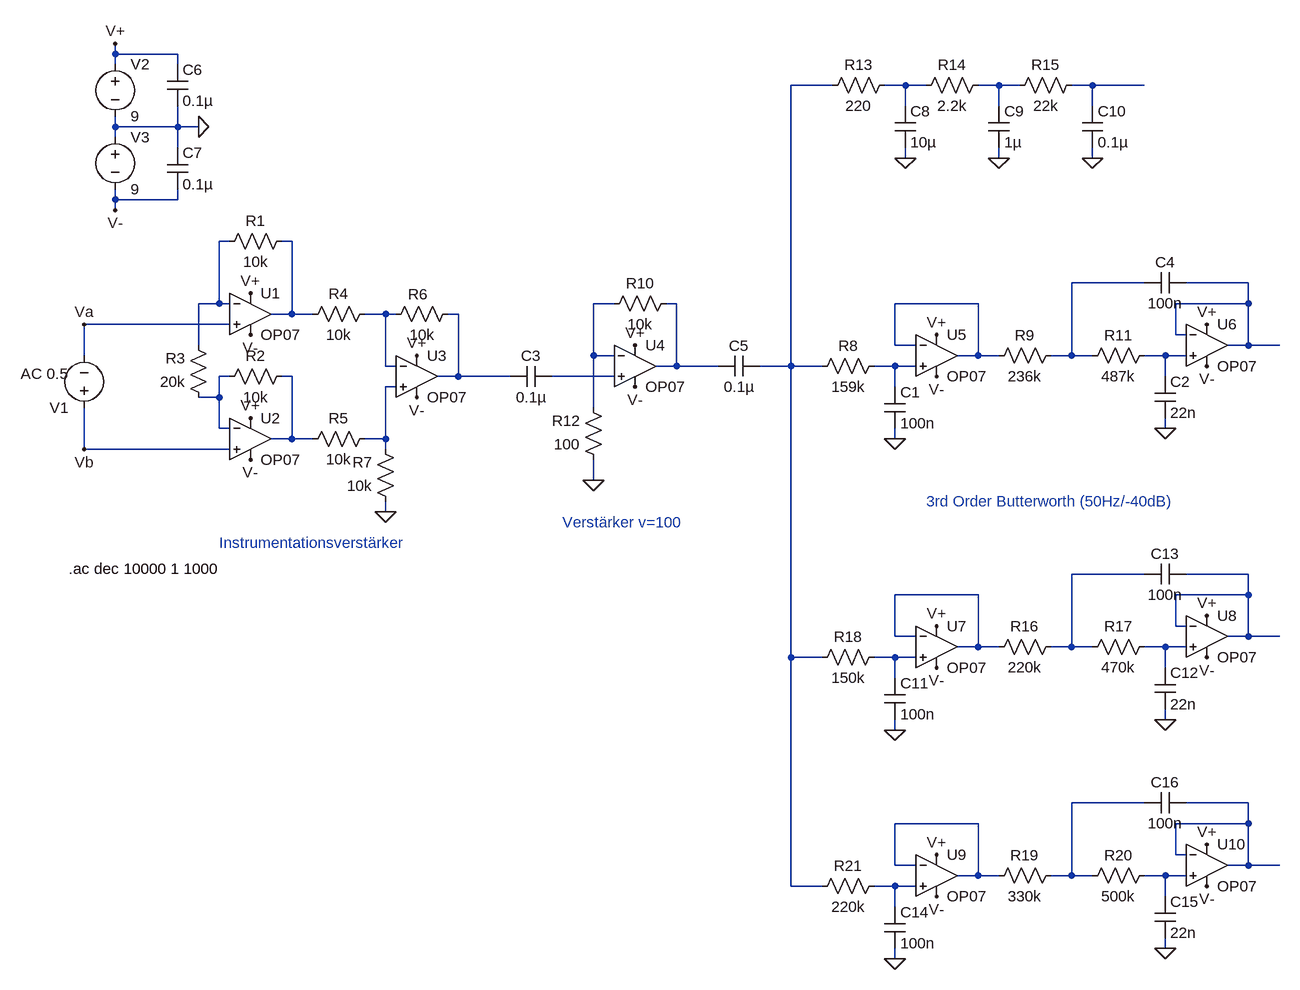
[diagram p0: schematic ekg_v2_butterworth.asc]
ekg_v2_butterworth.asc, the LTspice schematic file:
Version 4
SHEET 1 2228 1156
WIRE 432 -256 432 -272
WIRE 528 -256 432 -256
WIRE 432 -240 432 -256
WIRE 528 -240 528 -256
WIRE 1536 -208 1472 -208
WIRE 1648 -208 1616 -208
WIRE 1680 -208 1648 -208
WIRE 1792 -208 1760 -208
WIRE 1824 -208 1792 -208
WIRE 1936 -208 1904 -208
WIRE 2016 -208 1936 -208
WIRE 1648 -176 1648 -208
WIRE 1792 -176 1792 -208
WIRE 1936 -176 1936 -208
WIRE 432 -144 432 -160
WIRE 528 -144 528 -176
WIRE 528 -144 432 -144
WIRE 560 -144 528 -144
WIRE 432 -128 432 -144
WIRE 528 -112 528 -144
WIRE 1648 -96 1648 -112
WIRE 1792 -96 1792 -112
WIRE 1936 -96 1936 -112
WIRE 432 -32 432 -48
WIRE 528 -32 528 -48
WIRE 528 -32 432 -32
WIRE 432 -16 432 -32
WIRE 608 32 592 32
WIRE 704 32 688 32
WIRE 2016 96 1904 96
WIRE 2176 96 2080 96
WIRE 592 128 592 32
WIRE 592 128 560 128
WIRE 608 128 592 128
WIRE 1200 128 1168 128
WIRE 1296 128 1280 128
WIRE 1760 128 1632 128
WIRE 2176 128 2176 96
WIRE 2176 128 2064 128
WIRE 704 144 704 32
WIRE 704 144 672 144
WIRE 736 144 704 144
WIRE 848 144 816 144
WIRE 864 144 848 144
WIRE 960 144 944 144
WIRE 608 160 384 160
WIRE 2064 176 2064 128
WIRE 2080 176 2064 176
WIRE 560 192 560 128
WIRE 1632 192 1632 128
WIRE 1664 192 1632 192
WIRE 2176 192 2176 128
WIRE 2176 192 2144 192
WIRE 2224 192 2176 192
WIRE 384 208 384 160
WIRE 1168 208 1168 128
WIRE 1200 208 1168 208
WIRE 1760 208 1760 128
WIRE 1760 208 1728 208
WIRE 1792 208 1760 208
WIRE 1904 208 1904 96
WIRE 1904 208 1872 208
WIRE 1936 208 1904 208
WIRE 2048 208 2016 208
WIRE 2080 208 2048 208
WIRE 848 224 848 144
WIRE 864 224 848 224
WIRE 1296 224 1296 128
WIRE 1296 224 1264 224
WIRE 1360 224 1296 224
WIRE 1472 224 1472 -208
WIRE 1472 224 1424 224
WIRE 1520 224 1472 224
WIRE 1632 224 1600 224
WIRE 1664 224 1632 224
WIRE 608 240 592 240
WIRE 704 240 688 240
WIRE 960 240 960 144
WIRE 960 240 928 240
WIRE 1040 240 960 240
WIRE 1200 240 1104 240
WIRE 2048 240 2048 208
WIRE 864 256 848 256
WIRE 1632 256 1632 224
WIRE 592 272 592 240
WIRE 592 272 560 272
WIRE 1168 288 1168 208
WIRE 592 320 592 272
WIRE 608 320 592 320
WIRE 2048 320 2048 304
WIRE 704 336 704 240
WIRE 704 336 672 336
WIRE 736 336 704 336
WIRE 848 336 848 256
WIRE 848 336 816 336
WIRE 1632 336 1632 320
WIRE 384 352 384 288
WIRE 608 352 384 352
WIRE 848 352 848 336
WIRE 1168 400 1168 368
WIRE 848 448 848 432
WIRE 2016 544 1904 544
WIRE 2176 544 2080 544
WIRE 1760 576 1632 576
WIRE 2176 576 2176 544
WIRE 2176 576 2064 576
WIRE 2064 624 2064 576
WIRE 2080 624 2064 624
WIRE 1632 640 1632 576
WIRE 1664 640 1632 640
WIRE 2176 640 2176 576
WIRE 2176 640 2144 640
WIRE 2224 640 2176 640
WIRE 1760 656 1760 576
WIRE 1760 656 1728 656
WIRE 1792 656 1760 656
WIRE 1904 656 1904 544
WIRE 1904 656 1872 656
WIRE 1936 656 1904 656
WIRE 2048 656 2016 656
WIRE 2080 656 2048 656
WIRE 1472 672 1472 224
WIRE 1520 672 1472 672
WIRE 1632 672 1600 672
WIRE 1664 672 1632 672
WIRE 2048 688 2048 656
WIRE 1632 704 1632 672
WIRE 2048 768 2048 752
WIRE 1632 784 1632 768
WIRE 2016 896 1904 896
WIRE 2176 896 2080 896
WIRE 1760 928 1632 928
WIRE 2176 928 2176 896
WIRE 2176 928 2064 928
WIRE 2064 976 2064 928
WIRE 2080 976 2064 976
WIRE 1632 992 1632 928
WIRE 1664 992 1632 992
WIRE 2176 992 2176 928
WIRE 2176 992 2144 992
WIRE 2224 992 2176 992
WIRE 1760 1008 1760 928
WIRE 1760 1008 1728 1008
WIRE 1792 1008 1760 1008
WIRE 1904 1008 1904 896
WIRE 1904 1008 1872 1008
WIRE 1936 1008 1904 1008
WIRE 2048 1008 2016 1008
WIRE 2080 1008 2048 1008
WIRE 1472 1024 1472 672
WIRE 1520 1024 1472 1024
WIRE 1632 1024 1600 1024
WIRE 1664 1024 1632 1024
WIRE 2048 1040 2048 1008
WIRE 1632 1056 1632 1024
WIRE 2048 1120 2048 1104
WIRE 1632 1136 1632 1120
FLAG 848 448 0
FLAG 432 -272 V+
FLAG 640 176 V-
FLAG 640 368 V-
FLAG 896 272 V-
FLAG 560 -144 0
FLAG 432 -16 V-
FLAG 640 112 V+
FLAG 896 208 V+
FLAG 640 304 V+
FLAG 1168 400 0
FLAG 1232 192 V+
FLAG 1232 256 V-
FLAG 384 160 Va
FLAG 384 352 Vb
FLAG 1632 336 0
FLAG 2048 320 0
FLAG 1696 176 V+
FLAG 2112 160 V+
FLAG 1696 240 V-
FLAG 2112 224 V-
FLAG 1648 -96 0
FLAG 1792 -96 0
FLAG 1936 -96 0
FLAG 1632 784 0
FLAG 2048 768 0
FLAG 1696 624 V+
FLAG 2112 608 V+
FLAG 1696 688 V-
FLAG 2112 672 V-
FLAG 1632 1136 0
FLAG 2048 1120 0
FLAG 1696 976 V+
FLAG 2112 960 V+
FLAG 1696 1040 V-
FLAG 2112 1024 V-
SYMBOL OpAmps\\OP07 640 80 R0
SYMATTR InstName U1
SYMBOL OpAmps\\OP07 640 272 R0
SYMATTR InstName U2
SYMBOL OpAmps\\OP07 896 176 R0
SYMATTR InstName U3
SYMBOL res 704 224 R90
WINDOW 0 0 56 VBottom 2
WINDOW 3 32 56 VTop 2
SYMATTR InstName R2
SYMATTR Value 10k
SYMBOL res 704 16 R90
WINDOW 0 0 56 VBottom 2
WINDOW 3 32 56 VTop 2
SYMATTR InstName R1
SYMATTR Value 10k
SYMBOL res 576 288 R180
WINDOW 0 36 76 Left 2
WINDOW 3 36 40 Left 2
SYMATTR InstName R3
SYMATTR Value 20k
SYMBOL res 832 128 R90
WINDOW 0 0 56 VBottom 2
WINDOW 3 32 56 VTop 2
SYMATTR InstName R4
SYMATTR Value 10k
SYMBOL res 832 320 R90
WINDOW 0 0 56 VBottom 2
WINDOW 3 32 56 VTop 2
SYMATTR InstName R5
SYMATTR Value 10k
SYMBOL res 960 128 R90
WINDOW 0 1 62 VBottom 2
WINDOW 3 32 56 VTop 2
SYMATTR InstName R6
SYMATTR Value 10k
SYMBOL res 864 448 R180
WINDOW 0 36 76 Left 2
WINDOW 3 36 40 Left 2
SYMATTR InstName R7
SYMATTR Value 10k
SYMBOL voltage 384 304 R180
WINDOW 123 24 68 Left 2
WINDOW 39 0 0 Left 0
SYMATTR Value2 AC 0.5
SYMATTR InstName V1
SYMATTR Value ""
SYMBOL voltage 432 -256 R0
WINDOW 123 0 0 Left 0
WINDOW 39 0 0 Left 0
SYMATTR InstName V2
SYMATTR Value 9
SYMBOL voltage 432 -144 R0
SYMATTR InstName V3
SYMATTR Value 9
SYMBOL OpAmps\\OP07 1232 160 R0
SYMATTR InstName U4
SYMBOL res 1296 112 R90
WINDOW 0 0 56 VBottom 2
WINDOW 3 32 56 VTop 2
SYMATTR InstName R10
SYMATTR Value 10k
SYMBOL res 1184 384 R180
WINDOW 0 36 76 Left 2
WINDOW 3 36 40 Left 2
SYMATTR InstName R12
SYMATTR Value 100
SYMBOL cap 1104 224 R90
WINDOW 0 0 32 VBottom 2
WINDOW 3 32 32 VTop 2
SYMATTR InstName C3
SYMATTR Value 0.1µ
SYMBOL cap 1424 208 R90
WINDOW 0 0 32 VBottom 2
WINDOW 3 32 32 VTop 2
SYMATTR InstName C5
SYMATTR Value 0.1µ
SYMBOL cap 512 -240 R0
SYMATTR InstName C6
SYMATTR Value 0.1µ
SYMBOL cap 512 -112 R0
SYMATTR InstName C7
SYMATTR Value 0.1µ
SYMBOL OpAmps\\OP07 1696 144 R0
SYMATTR InstName U5
SYMBOL res 1616 208 R90
WINDOW 0 0 56 VBottom 2
WINDOW 3 32 56 VTop 2
SYMATTR InstName R8
SYMATTR Value 159k
SYMBOL cap 1616 256 R0
SYMATTR InstName C1
SYMATTR Value 100n
SYMBOL res 1888 192 R90
WINDOW 0 0 56 VBottom 2
WINDOW 3 32 56 VTop 2
SYMATTR InstName R9
SYMATTR Value 236k
SYMBOL res 2032 192 R90
WINDOW 0 0 56 VBottom 2
WINDOW 3 32 56 VTop 2
SYMATTR InstName R11
SYMATTR Value 487k
SYMBOL cap 2032 240 R0
SYMATTR InstName C2
SYMATTR Value 22n
SYMBOL OpAmps\\OP07 2112 128 R0
SYMATTR InstName U6
SYMBOL cap 2080 80 R90
WINDOW 0 0 32 VBottom 2
WINDOW 3 32 32 VTop 2
SYMATTR InstName C4
SYMATTR Value 100n
SYMBOL res 1632 -224 R90
WINDOW 0 0 56 VBottom 2
WINDOW 3 32 56 VTop 2
SYMATTR InstName R13
SYMATTR Value 220
SYMBOL res 1776 -224 R90
WINDOW 0 0 56 VBottom 2
WINDOW 3 32 56 VTop 2
SYMATTR InstName R14
SYMATTR Value 2.2k
SYMBOL res 1920 -224 R90
WINDOW 0 0 56 VBottom 2
WINDOW 3 32 56 VTop 2
SYMATTR InstName R15
SYMATTR Value 22k
SYMBOL cap 1632 -176 R0
SYMATTR InstName C8
SYMATTR Value 10µ
SYMBOL cap 1776 -176 R0
SYMATTR InstName C9
SYMATTR Value 1µ
SYMBOL cap 1920 -176 R0
SYMATTR InstName C10
SYMATTR Value 0.1µ
SYMBOL OpAmps\\OP07 1696 592 R0
SYMATTR InstName U7
SYMBOL cap 1616 704 R0
SYMATTR InstName C11
SYMATTR Value 100n
SYMBOL res 1888 640 R90
WINDOW 0 0 56 VBottom 2
WINDOW 3 32 56 VTop 2
SYMATTR InstName R16
SYMATTR Value 220k
SYMBOL res 2032 640 R90
WINDOW 0 0 56 VBottom 2
WINDOW 3 32 56 VTop 2
SYMATTR InstName R17
SYMATTR Value 470k
SYMBOL cap 2032 688 R0
SYMATTR InstName C12
SYMATTR Value 22n
SYMBOL OpAmps\\OP07 2112 576 R0
SYMATTR InstName U8
SYMBOL cap 2080 528 R90
WINDOW 0 0 32 VBottom 2
WINDOW 3 32 32 VTop 2
SYMATTR InstName C13
SYMATTR Value 100n
SYMBOL res 1616 656 R90
WINDOW 0 0 56 VBottom 2
WINDOW 3 32 56 VTop 2
SYMATTR InstName R18
SYMATTR Value 150k
SYMBOL OpAmps\\OP07 1696 944 R0
SYMATTR InstName U9
SYMBOL cap 1616 1056 R0
SYMATTR InstName C14
SYMATTR Value 100n
SYMBOL res 1888 992 R90
WINDOW 0 0 56 VBottom 2
WINDOW 3 32 56 VTop 2
SYMATTR InstName R19
SYMATTR Value 330k
SYMBOL res 2032 992 R90
WINDOW 0 0 56 VBottom 2
WINDOW 3 32 56 VTop 2
SYMATTR InstName R20
SYMATTR Value 500k
SYMBOL cap 2032 1040 R0
SYMATTR InstName C15
SYMATTR Value 22n
SYMBOL OpAmps\\OP07 2112 928 R0
SYMATTR InstName U10
SYMBOL cap 2080 880 R90
WINDOW 0 0 32 VBottom 2
WINDOW 3 32 32 VTop 2
SYMATTR InstName C16
SYMATTR Value 100n
SYMBOL res 1616 1008 R90
WINDOW 0 0 56 VBottom 2
WINDOW 3 32 56 VTop 2
SYMATTR InstName R21
SYMATTR Value 220k
TEXT 592 496 Left 2 ;Instrumentationsverstärker
TEXT 360 536 Left 2 !.ac dec 10000 1 1000
TEXT 1120 464 Left 2 ;Verstärker v=100
TEXT 1680 432 Left 2 ;3rd Order Butterworth (50Hz/-40dB)

The netlist it stands for:
* ekg_v2_butterworth.asc
XU1 Va N005 V+ V- N006 LT1001  ; OP07, pins In+ In- V+ V- OUT
XU2 Vb N016 V+ V- N017 LT1001  ; OP07, pins In+ In- V+ V- OUT
XU3 N019 N012 V+ V- N013 LT1001  ; OP07, pins In+ In- V+ V- OUT
R2 N017 N016 10k
R1 N006 N005 10k
R3 N016 N005 20k
R4 N012 N006 10k
R5 N019 N017 10k
R6 N013 N012 10k
R7 0 N019 10k
V1 Vb Va AC 0.5
V2 V+ 0 9
V3 0 V- 9
XU4 N018 N009 V+ V- N010 LT1001  ; OP07, pins In+ In- V+ V- OUT
R10 N010 N009 10k
R12 0 N009 100
C3 N018 N013 0.1µ
C5 N001 N010 0.1µ
C6 V+ 0 0.1µ
C7 0 V- 0.1µ
XU5 N015 N011 V+ V- N011 LT1001  ; OP07, pins In+ In- V+ V- OUT
R8 N015 N001 159k
C1 N015 0 100n
R9 N007 N011 236k
R11 N014 N007 487k
C2 N014 0 22n
XU6 N014 N008 V+ V- N008 LT1001  ; OP07, pins In+ In- V+ V- OUT
C4 N008 N007 100n
R13 N002 N001 220
R14 N003 N002 2.2k
R15 N004 N003 22k
C8 N002 0 10µ
C9 N003 0 1µ
C10 N004 0 0.1µ
XU7 N024 N022 V+ V- N022 LT1001  ; OP07, pins In+ In- V+ V- OUT
C11 N024 0 100n
R16 N020 N022 220k
R17 N023 N020 470k
C12 N023 0 22n
XU8 N023 N021 V+ V- N021 LT1001  ; OP07, pins In+ In- V+ V- OUT
C13 N021 N020 100n
R18 N024 N001 150k
XU9 N029 N027 V+ V- N027 LT1001  ; OP07, pins In+ In- V+ V- OUT
C14 N029 0 100n
R19 N025 N027 330k
R20 N028 N025 500k
C15 N028 0 22n
XU10 N028 N026 V+ V- N026 LT1001  ; OP07, pins In+ In- V+ V- OUT
C16 N026 N025 100n
R21 N029 N001 220k
* Instrumentationsverstärker
.ac dec 10000 1 1000
* Verstärker v=100
* 3rd Order Butterworth (50Hz/-40dB)
.lib LTC.lib
.backanno
.end

* Results of the author's LTspice run, read from the files saved beside the schematic
* Operating Point, zero values left out:
*   V(v+) = 9 V
*   V(v-) = -9 V
*   I(V2) = -22.5 mA
*   I(V3) = -22.5 mA